# Altium schematic sheet ChargerDetection.SchDoc
size A4
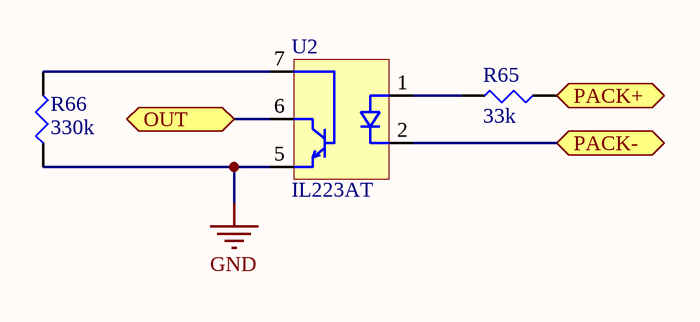
[diagram p0: ChargerDetection.SchDoc]

## Parts
R65  33k  [SMD-0603-RES]
R66  330k  [SMD-0603-RES]
U2  IL223AT  [SOIC-8]

## Ports
OUT, PACK+, PACK-

## Nets
GND: R66.1 U2.5(E)
OUT: U2.6(C) ; port OUT
PACK+: R65.1 ; port PACK+
PACK-: U2.2(K) ; port PACK-
NetR65_2: R65.2 U2.1(A)
NetR66_2: R66.2 U2.7(B)

## Library data of the parts
R65 = ERJ-3EKF3302V: RES SMD 33K OHM 1% 1/10W 0603; Manufacturer: Panasonic Electronic Components; Factory Stock: 0; Unit Price (USD): 0.00379; @ qty: 1500; Minimum Quantity: 1; Power (Watts): 0.1W, 1/10W; Temperature Coefficient: ±100ppm/°C; Part Number: ERJ-3EKF3302V; Datasheets: http://industrial.panasonic.com/www-cgi/jvcr13pz.cgi?E+PZ+3+AOA0002+ERJ3EKF3302V+7+WW; Image: //media.digikey.com/Photos/Panasonic%20Photos/MFG_ERJ-P6W%20Series.jpg; Digi-Key Part Number: P33.0KHCT-ND; Quantity Available: 240194; Packaging: Cut Tape (CT); Series: ERJ; Part Status: Active; Value: 33k; Tolerance: ±1%; Composition: Thick Film; Features: Automotive AEC-Q200; Operating Temperature: -55°C ~ 155°C; Package / Case: 0603 (1608 Metric); Supplier Device Package: 0603; Size / Dimension: 0.063" L x 0.031" W (1.60mm x 0.80mm); Height - Seated (Max): 0.022" (0.55mm); Number of Terminations: 2; Failure Rate: -
R66 = ERJ-3EKF3303V: RES SMD 330K OHM 1% 1/10W 0603; Manufacturer: Panasonic Electronic Components; Factory Stock: 0; Unit Price (USD): 0.00379; @ qty: 1500; Minimum Quantity: 1; Power (Watts): 0.1W, 1/10W; Temperature Coefficient: ±100ppm/°C; Part Number: ERJ-3EKF3303V; Datasheets: http://industrial.panasonic.com/www-cgi/jvcr13pz.cgi?E+PZ+3+AOA0002+ERJ3EKF3303V+7+WW; Image: //media.digikey.com/Photos/Panasonic%20Photos/MFG_ERJ-P6W%20Series.jpg; Digi-Key Part Number: P330KHCT-ND; Quantity Available: 124170; Packaging: Cut Tape (CT); Series: ERJ; Part Status: Active; Value: 330k; Tolerance: ±1%; Composition: Thick Film; Features: Automotive AEC-Q200; Operating Temperature: -55°C ~ 155°C; Package / Case: 0603 (1608 Metric); Supplier Device Package: 0603; Size / Dimension: 0.063" L x 0.031" W (1.60mm x 0.80mm); Height - Seated (Max): 0.022" (0.55mm); Number of Terminations: 2; Failure Rate: -
U2 = IL223AT: Optocoupler